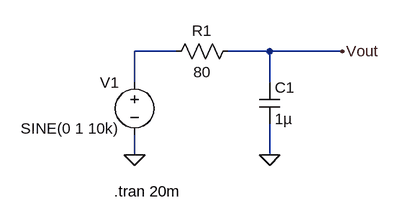
[diagram p0: schematic Filter - Transient.asc]
Filter - Transient.asc, the LTspice schematic file:
Version 4
SHEET 1 880 680
WIRE 128 64 64 64
WIRE 272 64 208 64
WIRE 384 64 272 64
WIRE 64 112 64 64
WIRE 272 112 272 64
WIRE 64 224 64 192
WIRE 272 224 272 176
FLAG 64 224 0
FLAG 272 224 0
FLAG 384 64 Vout
SYMBOL cap 256 112 R0
SYMATTR InstName C1
SYMATTR Value 1µ
SYMBOL res 224 48 R90
WINDOW 0 0 56 VBottom 2
WINDOW 3 32 56 VTop 2
SYMATTR InstName R1
SYMATTR Value 80
SYMBOL voltage 64 96 M0
WINDOW 123 28 120 Left 2
WINDOW 39 0 0 Left 0
WINDOW 3 24 87 Left 2
SYMATTR InstName V1
SYMATTR Value SINE(0 1 10k)
TEXT 32 280 Left 2 !.tran 20m

The netlist it stands for:
* Filter - Transient.asc
C1 Vout 0 1µ
R1 Vout N001 80
V1 N001 0 SINE(0 1 10k)
.tran 20m
.backanno
.end